# EAGLE schematic butter (EAGLE 6.5.0)
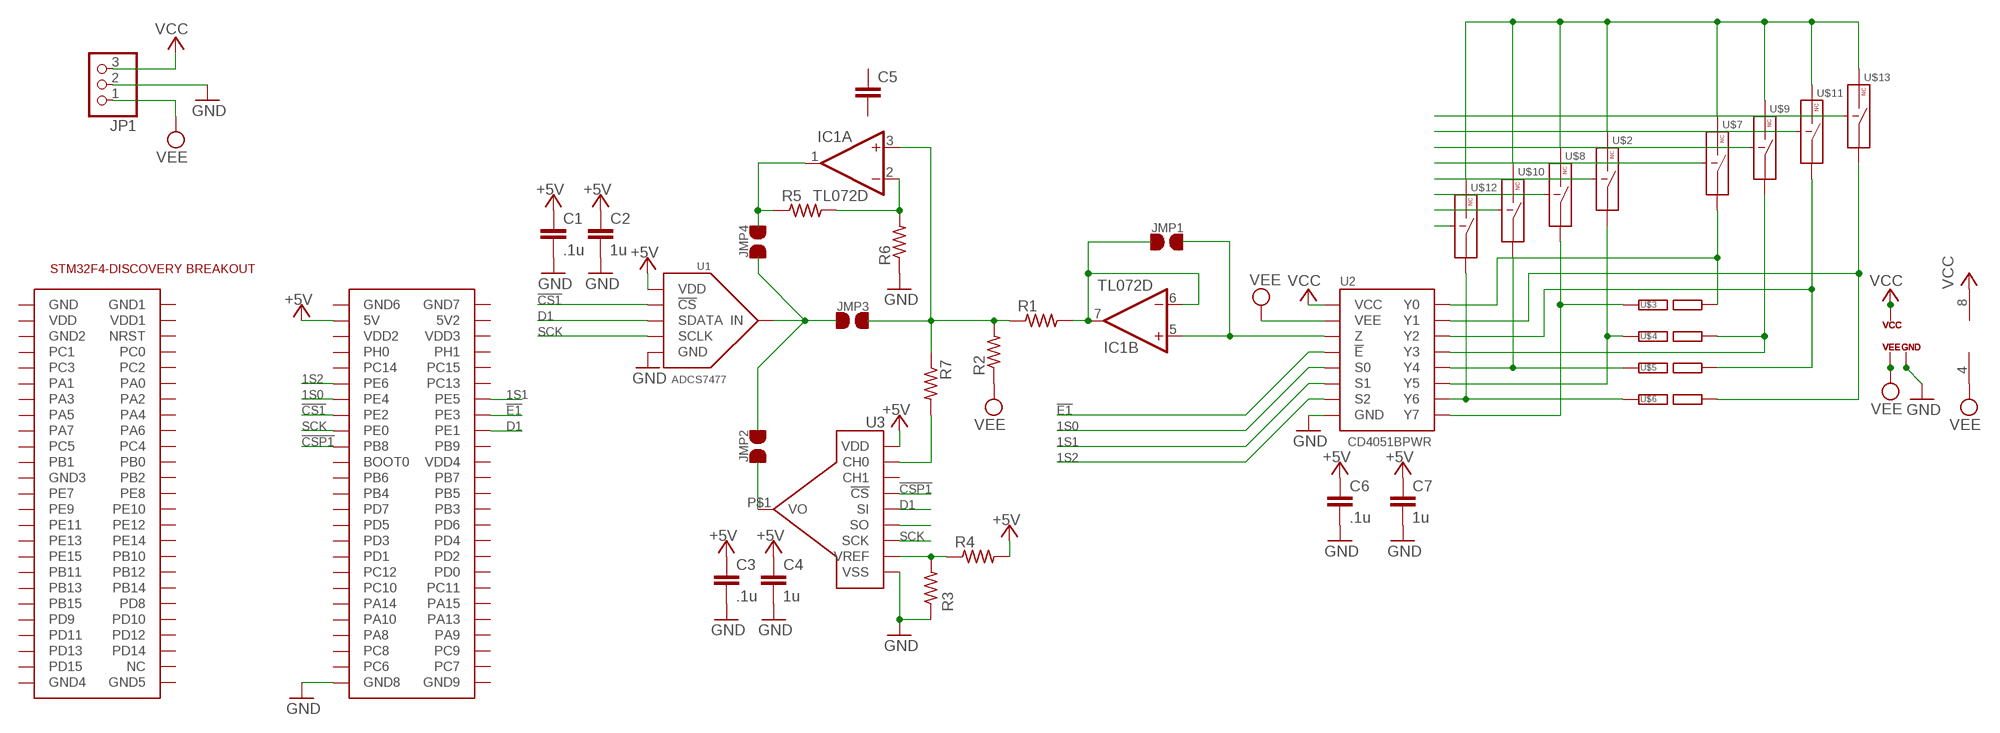
[diagram p0: schematic, sheet 1]

## Parts
C1  .1u  C-EUC0805  [C0805]
C2  1u  C-EUC0805  [C0805]
C3  .1u  C-EUC0805  [C0805]
C4  1u  C-EUC0805  [C0805]
C5  C-EUC0805  [C0805]
C6  .1u  C-EUC0805  [C0805]
C7  1u  C-EUC0805  [C0805]
IC1  TL072D  [SO08]
JMP1  JMP  [JMP]
JMP2  JMP  [JMP]
JMP3  JMP  [JMP]
JMP4  JMP  [JMP]
JP1  PINHD-1X3  [1X03]
R1  R-US_R0603  [R0603]
R2  R-US_R0603  [R0603]
R3  R-US_R0603  [R0603]
R4  R-US_R0603  [R0603]
R5  R-US_R0603  [R0603]
R6  R-US_R0603  [R0603]
R7  R-US_R0603  [R0603]
U1  ADCS7477  [SOT-23-6]
U2  CD4051BPWR  [TSSOP-16]
U3  MCP6S93  [MSOP-10]
U$1  STM32F4-DISCOVERY  [STM32F4-DISCOVERY]
U$2  DG467  [TSSOP-6]
U$3  RAILSEP  [RAIL]
U$4  RAILSEP  [RAIL]
U$5  RAILSEP  [RAIL]
U$6  RAILSEP  [RAIL]
U$7  DG467  [TSSOP-6]
U$8  DG467  [TSSOP-6]
U$9  DG467  [TSSOP-6]
U$10  DG467  [TSSOP-6]
U$11  DG467  [TSSOP-6]
U$12  DG467  [TSSOP-6]
U$13  DG467  [TSSOP-6]

## Nets
1S0: U2.P$11(S0) U$1.P$63(PE4)
1S1: U2.P$10(S1) U$1.P$64(PE5)
1S2: U2.P$9(S2) U$1.P$61(PE6)
!CS1: U1.P$6(!CS) U$1.P$65(PE2)
!CSP1: U3.P$6(!CS) U$1.P$69(PB8)
!E1: U2.P$6(!E) U$1.P$66(PE3)
+5V: C1.1 C2.1 C3.1 C4.1 C6.1 C7.1 R4.2 U1.P$1(VDD) U3.P$10(VDD) U$1.P$53(5V)
D1: U1.P$5(SDATA) U3.P$7(SI) U$1.P$68(PE1)
GND: C1.2 C2.2 C3.2 C4.2 C6.2 C7.2 JP1.2 R3.1 R6.1 U1.P$2(GND) U2.P$8(GND) U3.P$5(VSS) U$1.P$99(GND8) U$2.P$4(GND) U$7.P$4(GND) U$8.P$4(GND) U$9.P$4(GND) U$10.P$4(GND) U$11.P$4(GND) U$12.P$4(GND) U$13.P$4(GND)
N$1: IC1.2(A:-IN) R5.2 R6.2
N$2: U2.P$13(Y0) U$3.P$R(R) U$7.P$6(COM)
N$3: U2.P$5(Y5) U$2.P$6(COM) U$4.P$L(L)
N$4: IC1.5(B:+IN) JMP1.P$2 U2.P$3(Z)
N$5: JMP2.P$1 U3.P$1(VO)
N$6: IC1.6(B:-IN) IC1.7(B:OUT) JMP1.P$1 R1.2
N$7: U2.P$4(Y7) U$3.P$L(L) U$8.P$6(COM)
N$8: U2.P$12(Y3) U$4.P$R(R) U$9.P$6(COM)
N$9: U2.P$1(Y4) U$5.P$L(L) U$10.P$6(COM)
N$10: U2.P$15(Y2) U$5.P$R(R) U$11.P$6(COM)
N$11: U2.P$2(Y6) U$6.P$L(L) U$12.P$6(COM)
N$12: U2.P$14(Y1) U$6.P$R(R) U$13.P$6(COM)
N$13: U$2.P$3(CTL)
N$14: U$8.P$3(CTL)
N$15: U$10.P$3(CTL)
N$16: U$12.P$3(CTL)
N$17: U$7.P$3(CTL)
N$18: U$9.P$3(CTL)
N$19: U$11.P$3(CTL)
N$20: U$13.P$3(CTL)
N$21: U$2.P$1(IN) U$7.P$1(IN) U$8.P$1(IN) U$9.P$1(IN) U$10.P$1(IN) U$11.P$1(IN) U$12.P$1(IN) U$13.P$1(IN)
N$22: IC1.3(A:+IN) JMP3.P$2 R1.1 R2.2 R7.1
N$23: R3.2 R4.1 U3.P$4(VREF)
N$24: JMP2.P$2 JMP3.P$1 JMP4.P$1 U1.P$3(IN)
N$25: U3.P$8(SO)
N$26: IC1.1(A:OUT) JMP4.P$2 R5.1
N$27: R7.2 U3.P$2(CH0)
SCK: U1.P$4(SCLK) U3.P$9(SCK) U$1.P$67(PE0)
VCC: IC1.8(P:V+) JP1.3 U2.P$16(VCC) U$2.P$5(VCC) U$7.P$5(VCC) U$8.P$5(VCC) U$9.P$5(VCC) U$10.P$5(VCC) U$11.P$5(VCC) U$12.P$5(VCC) U$13.P$5(VCC)
VEE: IC1.4(P:V-) JP1.1 R2.1 U2.P$7(VEE) U$2.P$2(VEE) U$7.P$2(VEE) U$8.P$2(VEE) U$9.P$2(VEE) U$10.P$2(VEE) U$11.P$2(VEE) U$12.P$2(VEE) U$13.P$2(VEE)
Unconnected: C5.1 C5.2 U3.P$3(CH1) U$1.P$1(GND) U$1.P$2(GND1) U$1.P$3(VDD) U$1.P$4(VDD1) U$1.P$5(GND2) U$1.P$6(NRST) U$1.P$7(PC1) U$1.P$8(PC0) U$1.P$9(PC3) U$1.P$10(PC2) U$1.P$11(PA1) U$1.P$12(PA0) U$1.P$13(PA3) U$1.P$14(PA2) U$1.P$15(PA5) U$1.P$16(PA4) U$1.P$17(PA7) U$1.P$18(PA6) U$1.P$19(PC5) U$1.P$20(PC4) U$1.P$21(PB1) U$1.P$22(PB0) U$1.P$23(GND3) U$1.P$24(PB2) U$1.P$25(PE7) U$1.P$26(PE8) U$1.P$27(PE9) U$1.P$28(PE10) U$1.P$29(PE11) U$1.P$30(PE12) U$1.P$31(PE13) U$1.P$32(PE14) U$1.P$33(PE15) U$1.P$34(PB10) U$1.P$35(PB11) U$1.P$36(PB12) U$1.P$37(PB13) U$1.P$38(PB14) U$1.P$39(PB15) U$1.P$40(PD8) U$1.P$41(PD9) U$1.P$42(PD10) U$1.P$43(PD11) U$1.P$44(PD12) U$1.P$45(PD13) U$1.P$46(PD14) U$1.P$47(PD15) U$1.P$48(NC) U$1.P$49(GND4) U$1.P$50(GND5) U$1.P$51(GND6) U$1.P$52(GND7) U$1.P$54(5V2) U$1.P$55(VDD2) U$1.P$56(VDD3) U$1.P$57(PH0) U$1.P$58(PH1) U$1.P$59(PC14) U$1.P$60(PC15) U$1.P$62(PC13) U$1.P$70(PB9) U$1.P$71(BOOT0) U$1.P$72(VDD4) U$1.P$73(PB6) U$1.P$74(PB7) U$1.P$75(PB4) U$1.P$76(PB5) U$1.P$77(PD7) U$1.P$78(PB3) U$1.P$79(PD5) U$1.P$80(PD6) U$1.P$81(PD3) U$1.P$82(PD4) U$1.P$83(PD1) U$1.P$84(PD2) U$1.P$85(PC12) U$1.P$86(PD0) U$1.P$87(PC10) U$1.P$88(PC11) U$1.P$89(PA14) U$1.P$90(PA15) U$1.P$91(PA10) U$1.P$92(PA13) U$1.P$93(PA8) U$1.P$94(PA9) U$1.P$95(PC8) U$1.P$96(PC9) U$1.P$97(PC6) U$1.P$98(PC7) U$1.P$100(GND9)

## Library data of the parts
C1-C7 = rcl:C-EU: CAPACITOR, European symbol
IC1 = linear:TL072: OP AMP
JMP1-JMP4 = butter:JMP
JP1 = pinhead:PINHD-1X3: PIN HEADER
R1-R7 = resistor:R-US_: RESISTOR, American symbol
U1 = butter:ADCS7477: TI ADCS7477 10 bit 1MSPS ADC 5V 10mW Digikey <http://www.digikey.com/product-detail/en/ADCS7477AIMF%2FNOPB/ADCS7477AIMF%2FNOPBTR-ND/568478>
U2 = butter:CD4051BPWR: CD4051BPWR TI 8:1 Analog Multiplexer Digikey <http://www.digikey.com/product-detail/en/CD4051BPWR/296-11993-1-ND/390442>
U3 = butter:MCP6S93
U$1 = STM32F4-DISCOVERY:STM32F4-DISCOVERY
U$2 U$7-U$13 = butter:DG467
U$3-U$6 = butter:RAILSEP